# Altium schematic sheet USB DV Stick 1V1_Sheet2.SchDoc: USB DV STICK
size B; CompanyName: LoneStar Designs; Organization: LoneStar Designs; Address1: 1005 Lela St; Address2: McKinney, Texas 75069; DocumentNumber: 190724-1; Revision: 1V1; SheetNumber: 2; SheetTotal: 3
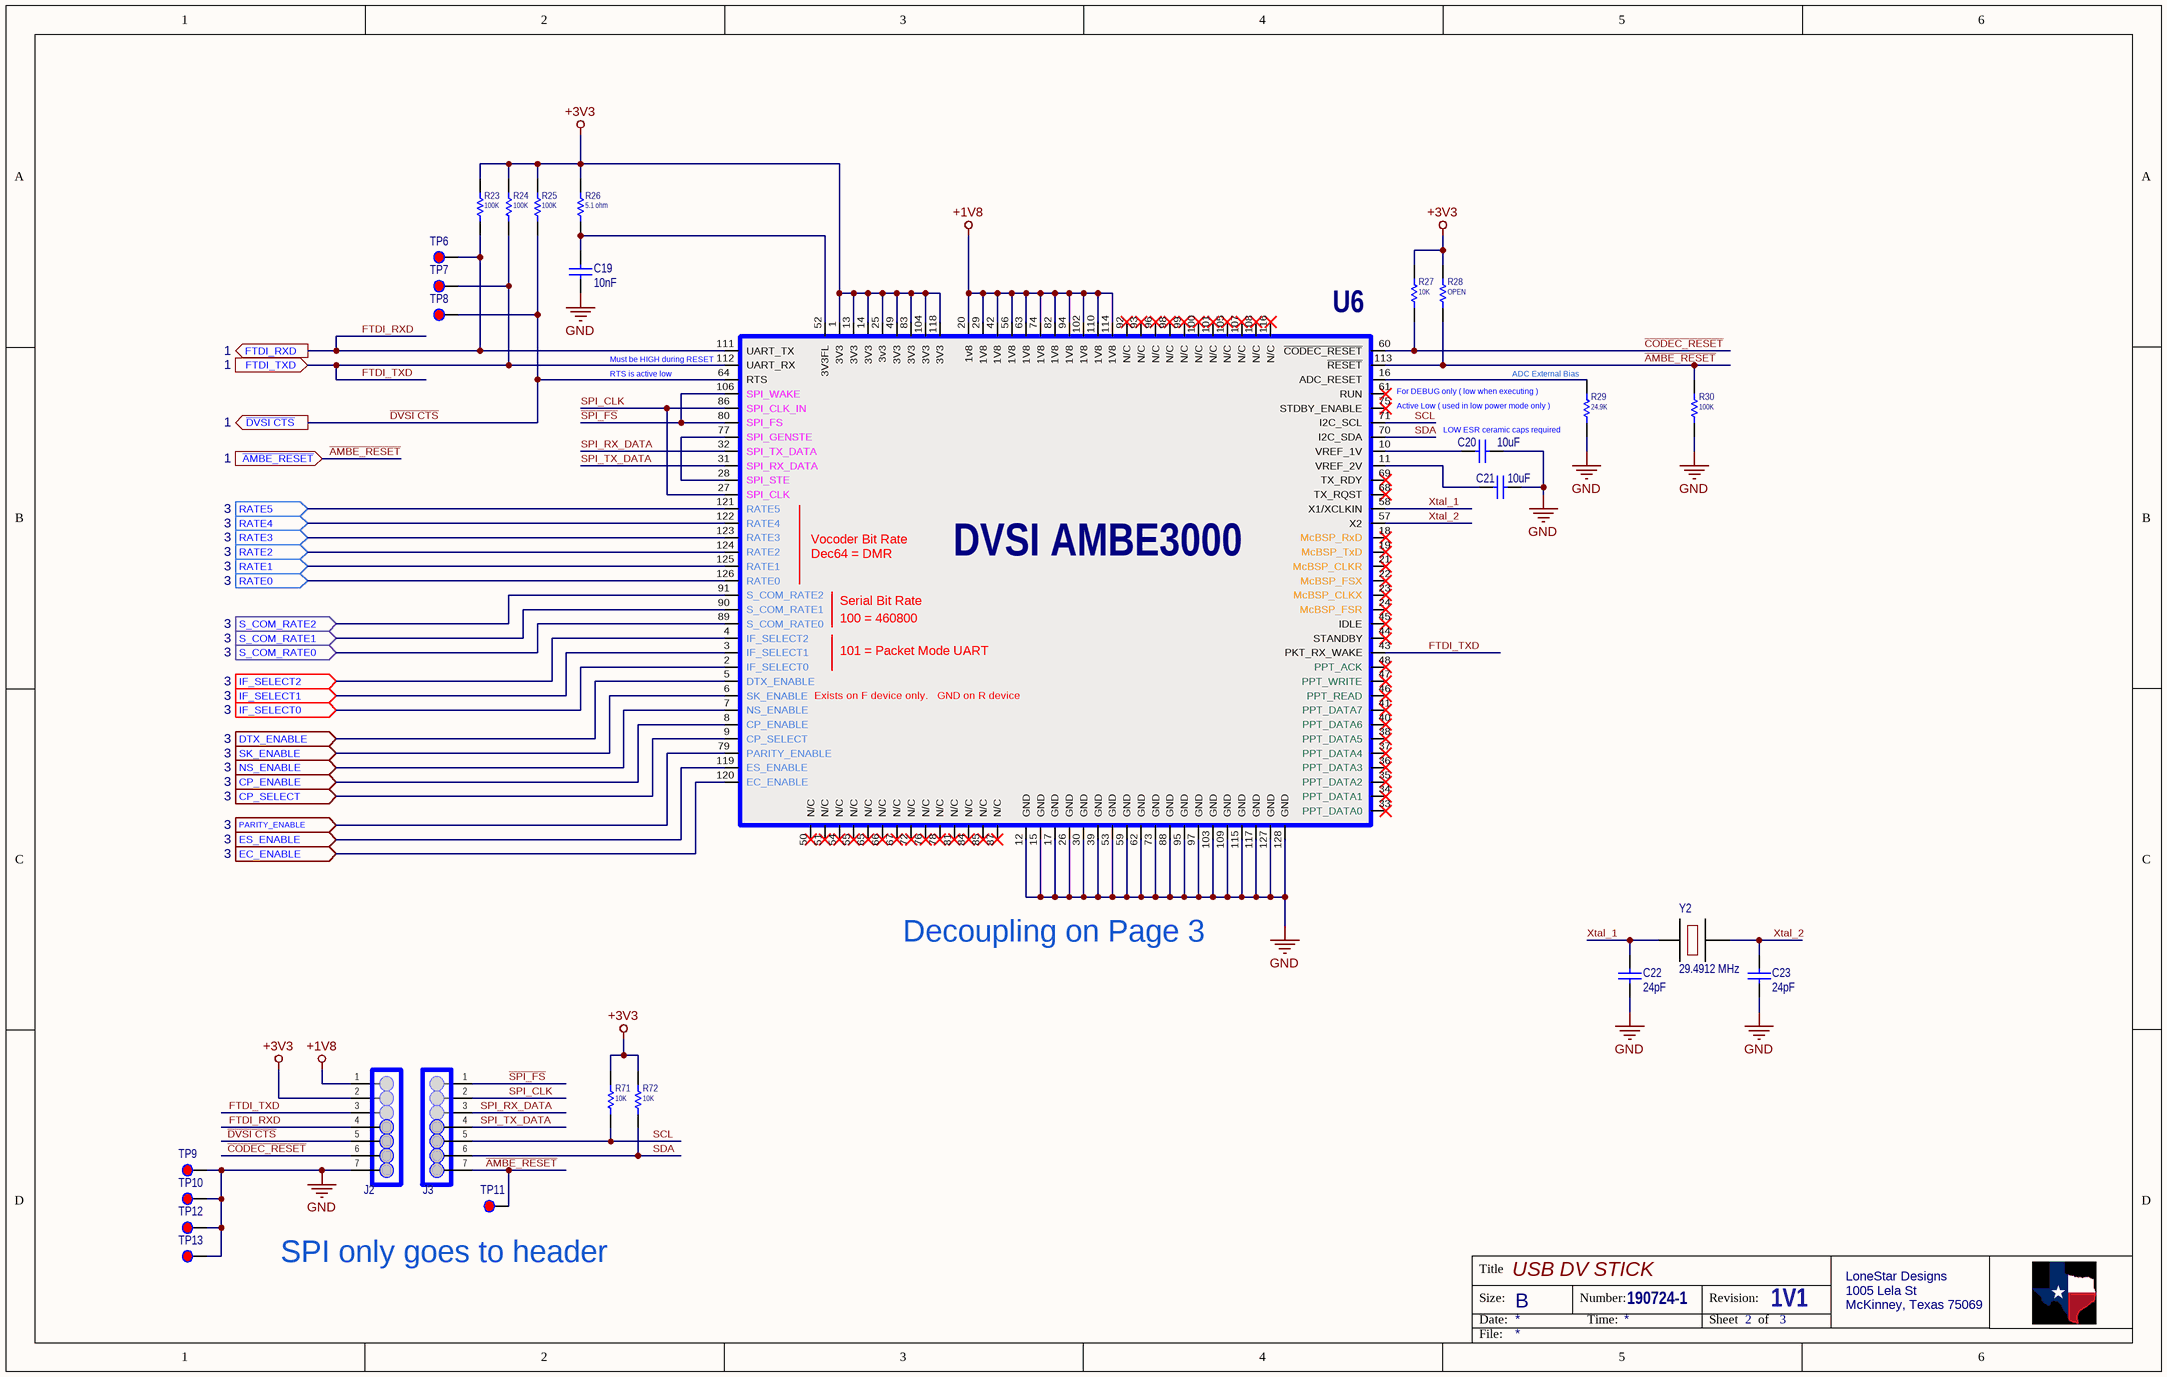
[diagram p0: USB DV Stick 1V1_Sheet2.SchDoc]

## Parts
C19  10nF  [C0402]
C20  10uF  [C0805]
C21  10uF  [C0805]
C22  24pF  [C0402]
C23  24pF  [C0402]
J2  7x1 on 0.1" centers  [HDR1x7]  (value not drawn)
J3  7x1 on 0.1" centers  [HDR1x7]  (value not drawn)
R23  100K  [R0603]
R24  100K  [R0603]
R25  100K  [R0603]
R26  5.1 ohm  [R0603]
R27  10K  [R0603]
R28  OPEN  [R0603]
R29  24.9K  [R0603]
R30  100K  [R0603]
R71  10K  [R0402]
R72  10K  [R0402]
TP6  5015  [TP SM]  (value not drawn)
TP7  5015  [TP SM]  (value not drawn)
TP8  5015  [TP SM]  (value not drawn)
TP9  5015  [TP SM]  (value not drawn)
TP10  5015  [TP SM]  (value not drawn)
TP11  5015  [TP SM]  (value not drawn)
TP12  5015  [TP SM]  (value not drawn)
TP13  5015  [TP SM]  (value not drawn)
U6  DVSI AMBE3000  [LQFP-128]
Y2  29.4912 MHz  [Xtal 5.0x3.2]

## Ports
CP_ENABLE (in, see 3), CP_SELECT (in, see 3), DTX_ENABLE (in, see 3), EC_ENABLE (in, see 3), ES_ENABLE (in, see 3), FTDI_RXD (out, see 1), FTDI_TXD (in, see 1), IF_SELECT0 (in, see 3), IF_SELECT1 (in, see 3), IF_SELECT2 (in, see 3), NS_ENABLE (in, see 3), PARITY_ENABLE (in, see 3), RATE0 (in, see 3), RATE1 (in, see 3), RATE2 (in, see 3), RATE3 (in, see 3), RATE4 (in, see 3), RATE5 (in, see 3), S_COM_RATE0 (in, see 3), S_COM_RATE1 (in, see 3), S_COM_RATE2 (in, see 3), SK_ENABLE (in, see 3), ~{AMBE_RESET} (in, see 1), ~{DVSI CTS} (out, see 1)

## Nets
+1V8: J2.1 U6.20(1v8) U6.29(1V8) U6.42(1V8) U6.56(1V8) U6.63(1V8) U6.74(1V8) U6.82(1V8) U6.94(1V8) U6.102(1V8) U6.110(1V8) U6.114(1V8)
+3V3: J2.2 R23.2 R24.2 R25.2 R26.2 R27.2 R28.2 R71.2 R72.2 U6.1(3V3) U6.13(3V3) U6.14(3V3) U6.25(3v3) U6.49(3V3) U6.83(3V3) U6.104(3V3) U6.118(3V3)
GND: C19.1 C20.2 C21.2 C22.1 C23.1 J2.7 R29.1 R30.1 TP9.1 TP10.1 TP12.1 TP13.1 U6.12(GND) U6.15(GND) U6.17(GND) U6.26(GND) U6.30(GND) U6.39(GND) U6.53(GND) U6.59(GND) U6.62(GND) U6.73(GND) U6.88(GND) U6.95(GND) U6.97(GND) U6.103(GND) U6.109(GND) U6.115(GND) U6.117(GND) U6.127(GND) U6.128(GND)
~{AMBE_RESET}: J3.7 R28.1 R30.2 TP11.1 U6.113(~{RESET}) ; port ~{AMBE_RESET}
~{CODEC_RESET}: J2.6 R27.1 U6.60(~{CODEC_RESET})
~{DVSI CTS}: J2.5 R25.1 TP8.1 U6.64(RTS) ; port ~{DVSI CTS}
~{SPI_FS}: J3.1 U6.80(SPI_FS) U6.106(SPI_WAKE)
CP_ENABLE: U6.8(CP_ENABLE) ; port CP_ENABLE
CP_SELECT: U6.9(CP_SELECT) ; port CP_SELECT
DTX_ENABLE: U6.5(DTX_ENABLE) ; port DTX_ENABLE
EC_ENABLE: U6.120(EC_ENABLE) ; port EC_ENABLE
ES_ENABLE: U6.119(ES_ENABLE) ; port ES_ENABLE
FTDI_RXD: J2.4 R23.1 TP6.1 U6.111(UART_TX) ; port FTDI_RXD
FTDI_TXD: J2.3 R24.1 TP7.1 U6.43(PKT_RX_WAKE) U6.112(UART_RX) ; port FTDI_TXD
IF_SELECT0: U6.2(IF_SELECT0) ; port IF_SELECT0
IF_SELECT1: U6.3(IF_SELECT1) ; port IF_SELECT1
IF_SELECT2: U6.4(IF_SELECT2) ; port IF_SELECT2
NS_ENABLE: U6.7(NS_ENABLE) ; port NS_ENABLE
PARITY_ENABLE: U6.79(PARITY_ENABLE) ; port PARITY_ENABLE
RATE0: U6.126(RATE0) ; port RATE0
RATE1: U6.125(RATE1) ; port RATE1
RATE2: U6.124(RATE2) ; port RATE2
RATE3: U6.123(RATE3) ; port RATE3
RATE4: U6.122(RATE4) ; port RATE4
RATE5: U6.121(RATE5) ; port RATE5
S_COM_RATE0: U6.89(S_COM_RATE0) ; port S_COM_RATE0
S_COM_RATE1: U6.90(S_COM_RATE1) ; port S_COM_RATE1
S_COM_RATE2: U6.91(S_COM_RATE2) ; port S_COM_RATE2
SCL: J3.5 R71.1 U6.71(I2C_SCL)
SDA: J3.6 R72.1 U6.70(I2C_SDA)
SK_ENABLE: U6.6(SK_ENABLE) ; port SK_ENABLE
SPI_CLK: J3.2 U6.27(SPI_CLK) U6.86(SPI_CLK_IN)
SPI_RX_DATA: J3.3 U6.32(SPI_TX_DATA)
SPI_TX_DATA: J3.4 U6.31(SPI_RX_DATA)
Xtal_1: C22.2 U6.58(X1/XCLKIN) Y2.1
Xtal_2: C23.2 U6.57(X2) Y2.2
NetC19_2: C19.2 R26.1 U6.52(3V3FL)
NetC20_1: C20.1 U6.10(VREF_1V)
NetC21_1: C21.1 U6.11(VREF_2V)
NetR29_2: R29.2 U6.16(ADC_RESET)
NetU6_28: U6.28(SPI_STE) U6.77(SPI_GENSTE)

Not connected (* = marked no-connect by the designer): U6 18(McBSP_RxD)* 19(McBSP_TxD)* 21(McBSP_CLKR)* 22(McBSP_FSX)* 23(McBSP_CLKX)* 24(McBSP_FSR)* 33(PPT_DATA0)* 34(PPT_DATA1)* 35(PPT_DATA2)* 36(PPT_DATA3)* 37(PPT_DATA4)* 38(PPT_DATA5)* 40(PPT_DATA6)* 41(PPT_DATA7)* 44(STANDBY)* 45(IDLE)* 46(PPT_READ)* 47(PPT_WRITE)* 48(PPT_ACK)* 50(N/C)* 51(N/C)* 54(N/C)* 55(N/C)* 61(RUN)* 65(N/C)* 66(N/C)* 67(N/C)* 68(TX_RQST)* 69(TX_RDY)* 72(N/C)* 75(STDBY_ENABLE)* 76(N/C)* 78(N/C)* 81(N/C)* 84(N/C)* 85(N/C)* 87(N/C)* 92(N/C)* 93(N/C)* 96(N/C)* 98(N/C)* 99(N/C)* 100(N/C)* 101(N/C)* 105(N/C)* 107(N/C)* 108(N/C)* 116(N/C)*

## Notes on the sheet
- RTS is active low
- (near U6) Must be HIGH during RESET
- (near U6) For DEBUG only ( low when executing )
- (near R29) ADC External Bias
- Active Low ( used in low power mode only )
- (near C20) LOW ESR ceramic caps required
- (near U6) Vocoder Bit Rate
- (near U6) Dec64 = DMR
- (near U6) Serial Bit Rate
- (near U6) 101 = Packet Mode UART
- (near U6) 100 = 460800
- (near U6) Exists on F device only.   GND on R device
- Decoupling on Page 3
- (near TP11) SPI only goes to header
- Title
- Size:
- Date:
- B
- Number:
- Time:
- Revision:
- Sheet
- of
- File:

## Library data of the parts
C19 = Cap SM: Capacitor Surface Mount; Manufacturer: Murata Electronics; Manufacturer Part Number: GCM155R71H103KA55D; PackageReference: C0402; PackageDescription: Chip Capacitor; Value: 10nF; Supplier 1: Mouser; Supplier Part Number 1: 81-GCM155R71H103KA5D
C20 C21 = Cap SM: Capacitor Surface Mount; Manufacturer: Murata Electronics; Manufacturer Part Number: GRJ21BR61E106KE01K; PackageReference: C0603; PackageDescription: Chip Capacitor; Value: 10uF; Supplier 1: Mouser; Supplier Part Number 1: 81-GRJ21BR61E106KE1K
C22 C23 = Cap SM: Capacitor Surface Mount; Manufacturer: Murata Electronics; Manufacturer Part Number: GCQ1555C1H240FB01D; PackageReference: C0603; PackageDescription: Chip Capacitor; Value: 24pF; Supplier 1: Mouser; Supplier Part Number 1: 81-GCQ1555C1H240FB1D
J2 J3 = 7x1 Pin Header: Supplier 1: N/A; Value: 7x1; PackageDescription: Through Hole; PackageReference: SIP; Manufacturer: N/A; Manufacturer Part Number: N/A; Supplier Part Number 1: N/A
R23-R25 R30 = RES SM: Resistor Surface Mount; Manufacturer: Vishay / Dale; Manufacturer Part Number: CRCW0603100KJNEAC; PackageReference: R0603; PackageDescription: Surface Mount; Value: 100K; Supplier 1: Mouser; Supplier Part Number 1: 71-CRCW0603100KJNEAC
R26 = RES SM: Resistor Surface Mount; Manufacturer: Vishay / Dale; Manufacturer Part Number: RCS06035R10FKEA; PackageReference: R0603; PackageDescription: Surface Mount; Value: 5.1 ohm; Supplier 1: Mouser; Supplier Part Number 1: 71-RCS06035R10FKEA
R27 R71 R72 = RES SM: Resistor Surface Mount; Manufacturer: Vishay / Dale; Manufacturer Part Number: CRCW060310K0FKEAC; PackageReference: R0603; PackageDescription: Surface Mount; Value: 10K; Supplier 1: Mouser; Supplier Part Number 1: 71-CRCW060310K0FKEAC
R28 = RES SM: Resistor Surface Mount; PackageReference: R0603; PackageDescription: Surface Mount; Value: OPEN; Supplier 1: N/A; Manufacturer: N/A; Supplier Part Number 1: N/A; Manufacturer Part Number: N/A
R29 = RES SM: Resistor Surface Mount; Manufacturer: Vishay / Dale; Manufacturer Part Number: CRCW060324K9FKEA; PackageReference: R0603; PackageDescription: Surface Mount; Value: 24.9K; Supplier 1: Mouser; Supplier Part Number 1: 71-CRCW0603-24.9K-E3
TP6-TP13 = Test Point: Surface Mount; Manufacturer: Keystone; Value: TP SM; Manufacturer Part Number: 5015; Supplier 1: Mouser; Supplier 2: Digi-Key; Supplier Part Number 1: 534-5015; Supplier Part Number 2: 36-5015CT-ND; PackageDescription: R0805; PackageReference: R0805
U6 = AMBE3000F_Pin_Modified: AMBE vocoder ( Logical Pin Order ); Manufacturer Part Number: AMBE3000R; Value: AMBE3000R; Supplier 1: DVSI; Supplier Part Number 1: AMBE3000R; Manufacturer: DVSI; PackageDescription: 128 PIN LQFP
Y2 = Xtal: Surface Mount Crystal  ( 5.0 x 3.2 ); Manufacturer Part Number: ABM3-29.4912MHZ-B4Y-T; Manufacturer: ABRACON; Value: 29.4912 MHz; Supplier 1: Mouser; Supplier Part Number 1: 815-ABM3294912B4YT; PackageDescription: 5.0 x 3.2 mm; PackageReference: 5.0x3.2 mm